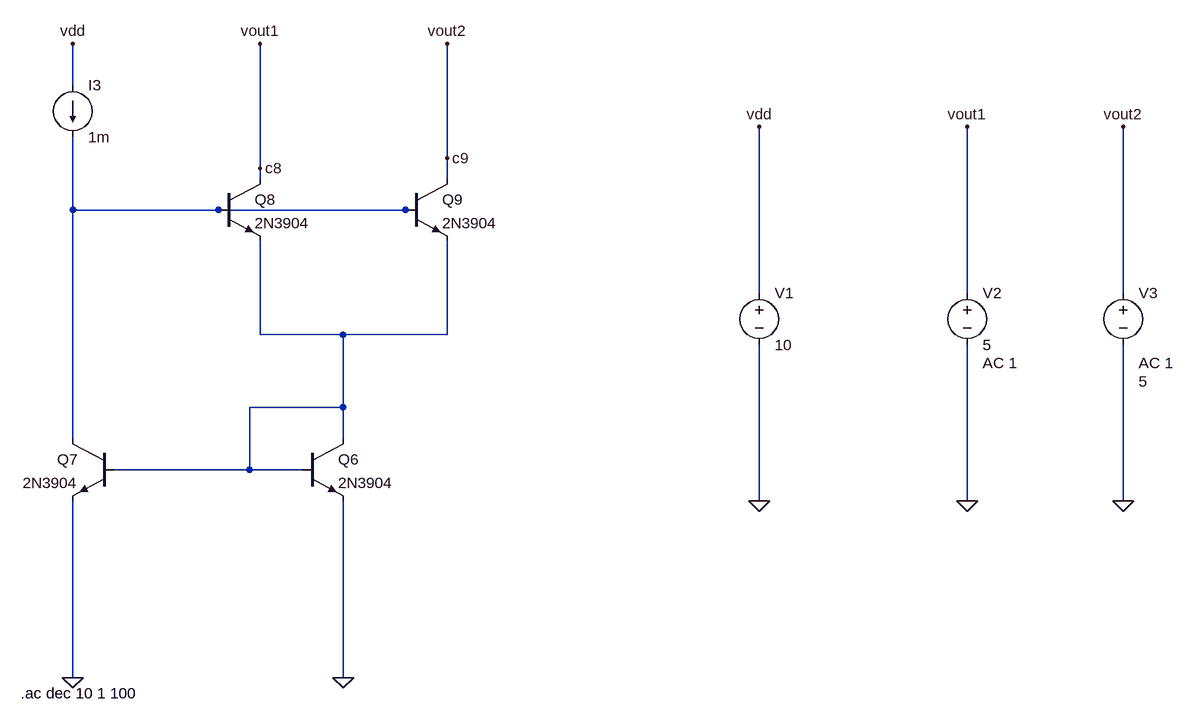
[diagram p0: schematic meros 1o (c).asc]
meros 1o (c).asc, the LTspice schematic file:
Version 4
SHEET 1 2416 696
WIRE 720 -256 720 -320
WIRE 1296 -144 1296 -320
WIRE 1008 -128 1008 -320
WIRE 1008 -112 1008 -128
WIRE 1296 -112 1296 -144
WIRE 720 -64 720 -176
WIRE 944 -64 720 -64
WIRE 1232 -64 944 -64
WIRE 1248 -64 1232 -64
WIRE 1776 64 1776 -192
WIRE 2096 64 2096 -192
WIRE 2336 64 2336 -192
WIRE 1008 128 1008 -16
WIRE 1136 128 1008 128
WIRE 1296 128 1296 -16
WIRE 1296 128 1136 128
WIRE 1136 240 1136 128
WIRE 1136 240 992 240
WIRE 720 288 720 -64
WIRE 1136 288 1136 240
WIRE 992 336 992 240
WIRE 992 336 784 336
WIRE 1072 336 992 336
WIRE 1776 384 1776 144
WIRE 2096 384 2096 144
WIRE 2336 384 2336 144
WIRE 720 656 720 384
WIRE 1136 656 1136 384
FLAG 720 656 0
FLAG 1136 656 0
FLAG 1776 384 0
FLAG 2096 384 0
FLAG 720 -320 vdd
FLAG 1776 -192 vdd
FLAG 1008 -320 vout1
FLAG 2096 -192 vout1
FLAG 2336 384 0
FLAG 2336 -192 vout2
FLAG 1296 -320 vout2
FLAG 1296 -144 c9
FLAG 1008 -128 c8
SYMBOL npn 1232 -112 R0
SYMATTR InstName Q9
SYMATTR Value 2N3904
SYMBOL npn 1072 288 R0
SYMATTR InstName Q6
SYMATTR Value 2N3904
SYMBOL npn 944 -112 R0
SYMATTR InstName Q8
SYMATTR Value 2N3904
SYMBOL npn 784 288 M0
SYMATTR InstName Q7
SYMATTR Value 2N3904
SYMBOL voltage 1776 48 R0
WINDOW 123 0 0 Left 0
WINDOW 39 0 0 Left 0
SYMATTR InstName V1
SYMATTR Value 10
SYMBOL voltage 2096 48 R0
WINDOW 123 24 124 Left 2
WINDOW 39 0 0 Left 0
SYMATTR Value2 AC 1
SYMATTR InstName V2
SYMATTR Value 5
SYMBOL voltage 2336 48 R0
WINDOW 3 24 152 Left 2
WINDOW 123 24 124 Left 2
WINDOW 39 0 0 Left 0
SYMATTR Value 5
SYMATTR Value2 AC 1
SYMATTR InstName V3
SYMBOL current 720 -256 R0
WINDOW 123 0 0 Left 0
WINDOW 39 0 0 Left 0
SYMATTR InstName I3
SYMATTR Value 1m
TEXT 640 680 Left 2 !.ac dec 10 1 100

The netlist it stands for:
* meros 1o (c).asc
Q9 c9 N001 N002 0 2N3904
Q6 N002 N002 0 0 2N3904
Q8 c8 N001 N002 0 2N3904
Q7 N001 N002 0 0 2N3904
V1 vdd 0 10
V2 c8 0 5 AC 1
V3 c9 0 5 AC 1
I3 vdd N001 1m
.model NPN NPN
.model PNP PNP
.lib standard.bjt
.ac dec 10 1 100
.backanno
.end